# Altium project Main_board_massage.PrjPcb
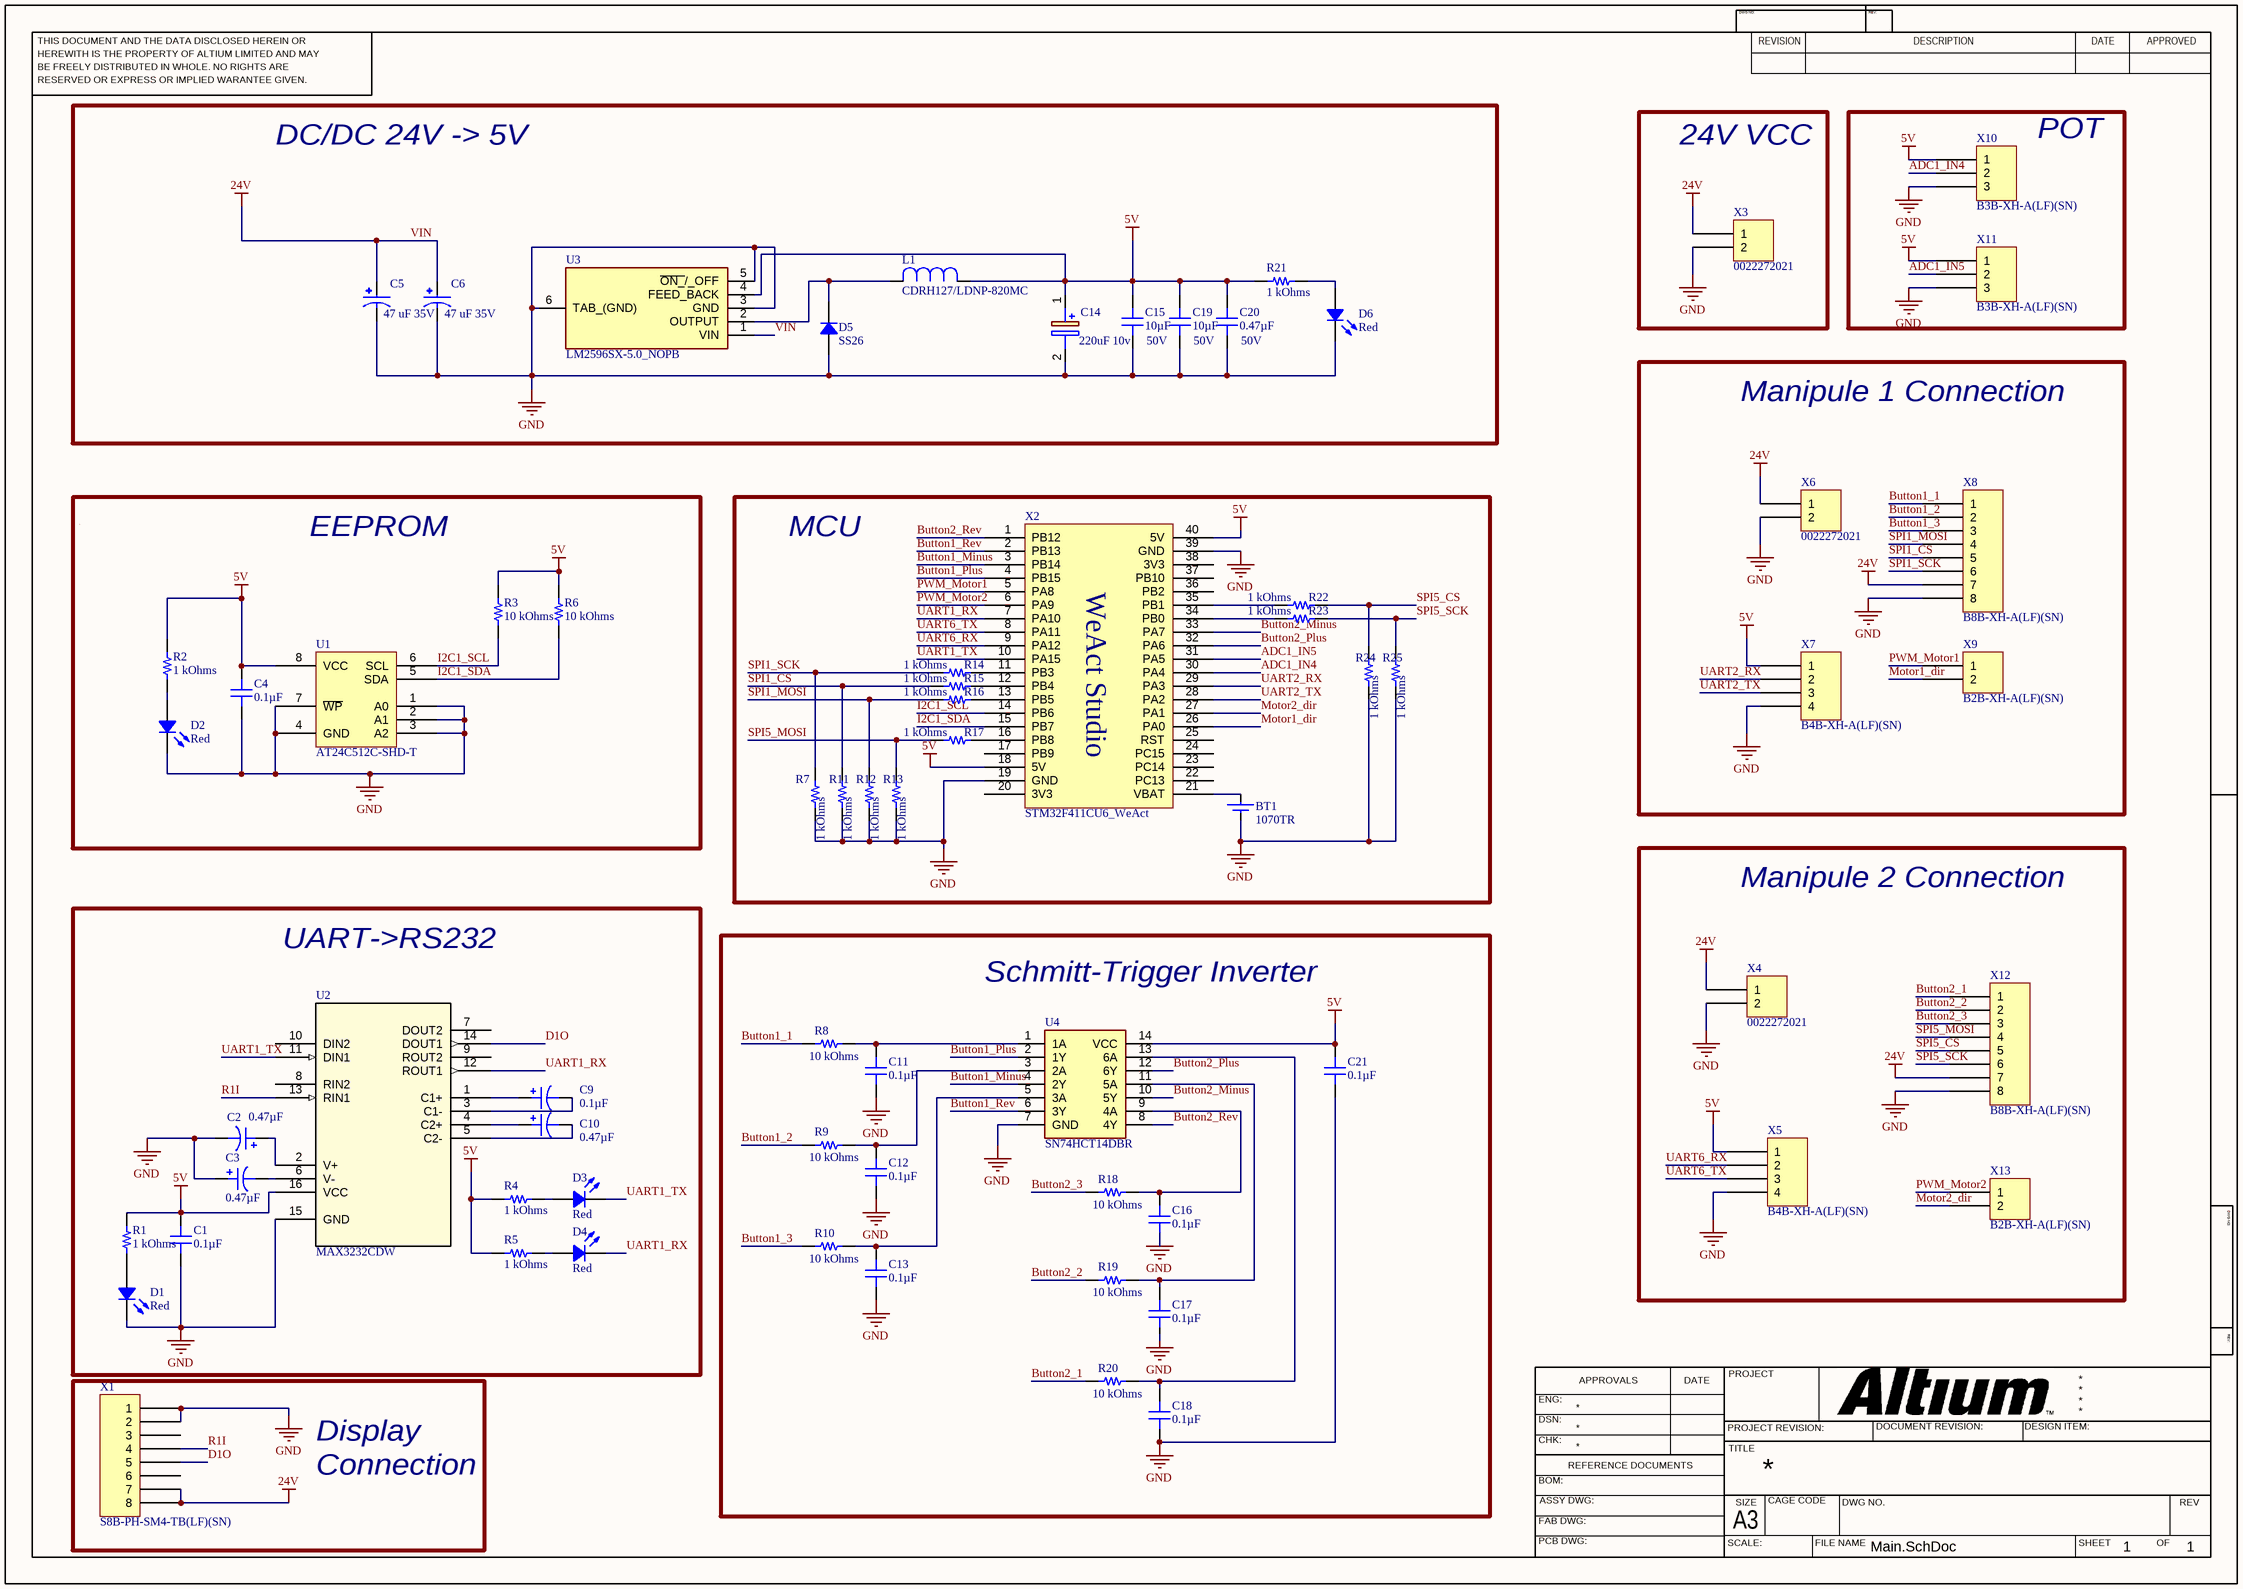
[diagram p0: Main.SchDoc]
1 sheet, 69 parts. Net scope: global (net labels, ports and power ports of the same name join across sheets).
Board file: Main_board.PcbDoc

## Sheet Main.SchDoc
size 420 x 297 mm; SheetNumber: 1; SheetTotal: 1

### Parts
BT1  1070TR  [1070TR]
C1  0.1µF  [CAP 0805_2012]
C2  0.47µF  [CAP POL 1206_3216]
C3  0.47µF  [CAP POL 1206_3216]
C4  0.1µF  [CAP 0805_2012]
C5  value 47 uF 35V  [CAP_EEHZA1V470P]  (hidden comment: EEHZA1V470P)
C6  value 47 uF 35V  [CAP_EEHZA1V470P]  (hidden comment: EEHZA1V470P)
C9  0.1µF  [CAP POL 1206_3216]
C10  0.47µF  [CAP POL 1206_3216]
C11  0.1µF  [CAP 0805_2012]
C12  0.1µF  [CAP 0805_2012]
C13  0.1µF  [CAP 0805_2012]
C14  Mouser Part Number: 220uF 10v  [CAPPM7343X430N]  (hidden comment: 293D227X9010E2TE3)
C15  Voltage - Rated: 50V  [CAP 0805_2012]  (hidden comment: 10µF)
C16  0.1µF  [CAP 0805_2012]
C17  0.1µF  [CAP 0805_2012]
C18  0.1µF  [CAP 0805_2012]
C19  Voltage - Rated: 50V  [CAP 0805_2012]  (hidden comment: 10µF)
C20  Voltage - Rated: 50V  [CAP 0805_2012]  (hidden comment: 0.47µF)
C21  0.1µF  [CAP 0805_2012]
D1  Red  [LED 0603_1608 RED]
D2  Red  [LED 0603_1608 RED]
D3  Red  [LED 0603_1608 RED]
D4  Red  [LED 0603_1608 RED]
D5  SS26  [DO214AA SMB]
D6  Red  [LED 0603_1608 RED]
L1  CDRH127/LDNP-820MC  [IND_CDRH127/LDNP-470MC_SUM]
R1  1 kOhms  [RES 0805_2012]
R2  1 kOhms  [RES 0805_2012]
R3  10 kOhms  [RES 0805_2012]
R4  1 kOhms  [RES 0805_2012]
R5  1 kOhms  [RES 0805_2012]
R6  10 kOhms  [RES 0805_2012]
R7  1 kOhms  [RES 0805_2012]
R8  10 kOhms  [RES 0805_2012]
R9  10 kOhms  [RES 0805_2012]
R10  10 kOhms  [RES 0805_2012]
R11  1 kOhms  [RES 0805_2012]
R12  1 kOhms  [RES 0805_2012]
R13  1 kOhms  [RES 0805_2012]
R14  1 kOhms  [RES 0805_2012]
R15  1 kOhms  [RES 0805_2012]
R16  1 kOhms  [RES 0805_2012]
R17  1 kOhms  [RES 0805_2012]
R18  10 kOhms  [RES 0805_2012]
R19  10 kOhms  [RES 0805_2012]
R20  10 kOhms  [RES 0805_2012]
R21  1 kOhms  [RES 0805_2012]
R22  1 kOhms  [RES 0805_2012]
R23  1 kOhms  [RES 0805_2012]
R24  1 kOhms  [RES 0805_2012]
R25  1 kOhms  [RES 0805_2012]
U1  AT24C512C-SHD-T  [MICROCHIP SOIC-8 208MIL WIDE]
U2  MAX3232CDW  [DW16]
U3  LM2596SX-5.0_NOPB  [KTT0005B]
U4  SN74HCT14DBR  [SOP65P780X200-14N]
X1  S8B-PH-SM4-TB(LF)(SN)  [JST S8B-PH-SM4-TB]
X2  STM32F411CU6_WeAct  [STM32F4x1CxU6 WeActStudio]
X3  0022272021  [MOLEX KK 0022272021]
X4  0022272021  [MOLEX KK 0022272021]
X5  B4B-XH-A(LF)(SN)  [JST XH B4B-XH-A]
X6  0022272021  [MOLEX KK 0022272021]
X7  B4B-XH-A(LF)(SN)  [JST XH B4B-XH-A]
X8  B8B-XH-A(LF)(SN)  [JST XH B8B-XH-A]
X9  B2B-XH-A(LF)(SN)  [JST XH B2B-XH-A]
X10  B3B-XH-A(LF)(SN)  [JST XH B3B-XH-A]
X11  B3B-XH-A(LF)(SN)  [JST XH B3B-XH-A]
X12  B8B-XH-A(LF)(SN)  [JST XH B8B-XH-A]
X13  B2B-XH-A(LF)(SN)  [JST XH B2B-XH-A]

### Blocks framed on the sheet
DC/DC 24V -> 5V: C5 C6 C14 C15 C19 C20 D5 D6 L1 R21 U3
24V VCC: X3
POT: X10 X11
Manipule 1 Connection: X6-X9
EEPROM: C4 D2 R2 R3 R6 U1
MCU: BT1 R7 R11-R17 R22-R25 X2
Manipule 2 Connection: X4 X5 X12 X13
UART->RS232: C1-C3 C9 C10 D1 D3 D4 R1 R4 R5 U2
Schmitt-Trigger Inverter: C11-C13 C16-C18 C21 R8-R10 R18-R20 U4

### Nets
5V: C1.2 C4.2 C14.1(+) C15.1 C19.1 C20.2 C21.2 L1.1 R1.2 R2.2 R3.2 R4.2 R5.2 R6.2 R21.2 U1.8(VCC) U2.16(VCC) U3.4(FEED_BACK) U4.14(VCC) X2.18(5V) X2.40(5V) X5.1 X7.1 X10.1 X11.1
GND: BT1.2(-) C1.1 C2.2 C3.1 C4.1 C5.2 C6.2 C11.1 C12.1 C13.1 C14.2(-) C15.2 C16.1 C17.1 C18.1 C19.2 C20.1 C21.1 D1.2 D2.2 D5.1 D6.2 R7.2 R11.2 R12.2 R13.2 R24.2 R25.2 U1.1(A0) U1.2(A1) U1.3(A2) U1.4(GND) U1.7(~{WP}) U2.15(GND) U3.3(GND) U3.5(~{ON_}/_OFF) U3.6(TAB_(GND)) U4.7(GND) X1.1 X1.2 X2.19(GND) X2.39(GND) X3.2 X4.2 X5.4 X6.2 X7.4 X8.8 X10.3 X11.3 X12.8
VIN: C5.1 C6.1 U3.1(VIN) X1.7 X1.8 X3.1 X4.1 X6.1 X8.7 X12.7  [also labelled 24V]
ADC1_IN4: X2.30(PA4) X10.2
ADC1_IN5: X2.31(PA5) X11.2
Button1_1: R8.2 X8.1
Button1_2: R9.2 X8.2
Button1_3: R10.2 X8.3
Button1_Minus: U4.4(2Y) X2.3(PB14)
Button1_Plus: U4.2(1Y) X2.4(PB15)
Button1_Rev: U4.6(3Y) X2.2(PB13)
Button2_1: R20.2 X12.1
Button2_2: R19.2 X12.2
Button2_3: R18.2 X12.3
Button2_Minus: U4.10(5Y) X2.33(PA7)
Button2_Plus: U4.12(6Y) X2.32(PA6)
Button2_Rev: U4.8(4Y) X2.1(PB12)
D1O: U2.14(DOUT1) X1.5
I2C1_SCL: R3.1 U1.6(SCL) X2.14(PB6)
I2C1_SDA: R6.1 U1.5(SDA) X2.15(PB7)
Motor1_dir: X2.26(PA0) X9.2
Motor2_dir: X2.27(PA1) X13.2
PWM_Motor1: X2.5(PA8) X9.1
PWM_Motor2: X2.6(PA9) X13.1
R1I: U2.13(RIN1) X1.4
SPI1_CS: R11.1 R15.2 X8.5
SPI1_MOSI: R12.1 R16.2 X8.4
SPI1_SCK: R7.1 R14.2 X8.6
SPI5_CS: R22.1 R24.1 X12.5
SPI5_MOSI: R13.1 R17.2 X12.4
SPI5_SCK: R23.1 R25.1 X12.6
UART1_RX: D4.2 U2.12(ROUT1) X2.7(PA10)
UART1_TX: D3.2 U2.11(DIN1) X2.10(PA15)
UART2_RX: X2.29(PA3) X7.2
UART2_TX: X2.28(PA2) X7.3
UART6_RX: X2.9(PA12) X5.2
UART6_TX: X2.8(PA11) X5.3
NetBT1_1: BT1.1(+) X2.21(VBAT)
NetC2_1: C2.1 U2.2(V+)
NetC3_2: C3.2 U2.6(V-)
NetC9_1: C9.1 U2.1(C1+)
NetC9_2: C9.2 U2.3(C1-)
NetC10_1: C10.1 U2.4(C2+)
NetC10_2: C10.2 U2.5(C2-)
NetC11_2: C11.2 R8.1 U4.1(1A)
NetC12_2: C12.2 R9.1 U4.3(2A)
NetC13_2: C13.2 R10.1 U4.5(3A)
NetC16_2: C16.2 R18.1 U4.9(4A)
NetC17_2: C17.2 R19.1 U4.11(5A)
NetC18_2: C18.2 R20.1 U4.13(6A)
NetD1_1: D1.1 R1.1
NetD2_1: D2.1 R2.1
NetD3_1: D3.1 R4.1
NetD4_1: D4.1 R5.1
NetD5_2: D5.2 L1.2 U3.2(OUTPUT)
NetD6_1: D6.1 R21.1
NetR14_1: R14.1 X2.11(PB3)
NetR15_1: R15.1 X2.12(PB4)
NetR16_1: R16.1 X2.13(PB5)
NetR17_1: R17.1 X2.16(PB8)
NetR22_2: R22.2 X2.35(PB1)
NetR23_2: R23.2 X2.34(PB0)

Not connected (* = marked no-connect by the designer): U2 7(DOUT2) 8(RIN2) 9(ROUT2) 10(DIN2); X1 3 6; X2 17(PB9) 20(3V3) 22(PC13) 23(PC14) 24(PC15) 25(RST) 36(PB2) 37(PB10) 38(3V3)

### Notes on the sheet
- Display
- Connection
- THIS DOCUMENT AND THE DATA DISCLOSED HEREIN OR
- HEREWITH IS THE PROPERTY OF ALTIUM LIMITED AND MAY
- DWG NO:
- REVISION
- REV:
- DESCRIPTION
- DATE
- APPROVED
- BE FREELY DISTRIBUTED IN WHOLE. NO RIGHTS ARE
- RESERVED OR EXPRESS OR IMPLIED WARANTEE GIVEN.
- ENG:
- APPROVALS
- PROJECT
- DSN:
- CHK:
- REFERENCE DOCUMENTS
- PROJECT REVISION:
- TITLE
- DOCUMENT REVISION:
- DESIGN ITEM:
- BOM:
- FAB DWG:
- PCB DWG:
- ASSY DWG:
- SCALE:
- A3
- SIZE
- CAGE CODE
- FILE NAME
- DWG NO.
- SHEET
- OF
- REV
- (in symbol STM32F411CU6_WeAct) WeAct Studio

### Library data of the parts
BT1 = 1070TR: Battery; Manufacturer_Name: Keystone Electronics; Datasheet Link: https://www.keyelco.com/product-pdf.cfm?p=14018; Height: 6.22mm; Manufacturer_Part_Number: 1070TR; Mouser Part Number: 534-1070TR; Mouser Price/Stock: https://www.mouser.co.uk/ProductDetail/Keystone-Electronics/1070TR?qs=76dmnhCH%2FMN2NfD64M7eLg%3D%3D
C1 C4 C11-C13 C16-C18 C21 = C0805C104K9RACAUTO: SMD AUTO X7R, CERAMIC, 0.1 UF, 1; Manufacturer: KEMET; Tolerance: ±10%; Voltage - Rated: 6.3V; Part Number: C0805C104K9RACAUTO; Value: 0.1µF; Applications: Automotive, Bypass, Decoupling; Capacitance: 0.1µF; ComponentLink1Description: Datasheet; ComponentLink1URL: https://api.kemet.com/component-edge/download/datasheet/C0805C104K9RACAUTO.pdf; ComponentLink2Description: DigiKey Link; ComponentLink2URL: http://digikey.com/product-detail/en/kemet/C0805C104K9RACAUTO/399-C0805C104K9RACAUTOCT-ND/10232873; Device Package: 0805 (2012 Metric); LastUpdated: 02.09.2020 01:04:08; Lifecycle Status: Active; Minimum Order: 1; Mounting Type: Surface Mount, MLCC; Operating Temperature: -55°C ~ 125°C; Package / Case: 0805 (2012 Metric); Packaging: TapeAndReel; PartId: 17729; Part Status: Active; Price: 0.05; Ratings: AEC-Q200; Series: SMD Auto X7R; Size / Dimension: 0.079" L x 0.049" W (2.00mm x 1.25mm); Supplier 1: DigiKey; Supplier Part Number 1: 399-C0805C104K9RACAUTOCT-ND; Temperature Coefficient: X7R; Thickness (Max): 0.035" (0.88mm)
C2 C3 C10 = 293D474X9035A2TE3: CAP TANT 0.47UF 10% 35V 1206; Manufacturer: Vishay Sprague; Manufacturer Size Code: A; ESR (Equivalent Series Resistance): 10Ohm; Type: Molded; Part Number: 293D474X9035A2TE3; Value: 0.47µF; Capacitance: 0.47µF; ComponentLink1Description: Datasheet; ComponentLink1URL: http://www.vishay.com/docs/40002/293d.pdf; ComponentLink2Description: DigiKey Link; ComponentLink2URL: http://digikey.com/product-detail/en/vishay-sprague/293D474X9035A2TE3/718-1808-1-ND/2259950; Device Package: 1206 (3216 Metric); Features: General Purpose; Height - Seated (Max): 0.071" (1.80mm); LastUpdated: 02.09.2020 01:15:57; Lifecycle Status: Active; Minimum Order: 1; Mounting Type: Surface Mount; Operating Temperature: -55°C ~ 125°C; Package / Case: 1206 (3216 Metric); Packaging: TapeAndReel; PartId: 592; Part Status: Active; Price: 0.12; Series: TANTAMOUNT®, 293D; Size / Dimension: 0.126" L x 0.063" W (3.20mm x 1.60mm); Supplier 1: DigiKey; Supplier Part Number 1: 718-1808-1-ND; Tolerance: ±10%; Voltage - Rated: 35V
C5 C6 = EEHZA1V470P: CAP ALUM POLY HYB 47UF 35V SMD; MF: {'manufacturer': u'Panasonic Electronic'}; Price: None; Package: None; MP: EEHZA1V470P; Availability: Unavailable
C9 = 293D104X0035A2TE3: CAP TANT 0.1UF 20% 35V 1206; Manufacturer: Vishay Sprague; Manufacturer Size Code: A; ESR (Equivalent Series Resistance): 20Ohm; Type: Molded; Part Number: 293D104X0035A2TE3; Value: 0.1µF; Capacitance: 0.1µF; ComponentLink1Description: Datasheet; ComponentLink1URL: http://www.vishay.com/docs/40002/293d.pdf; ComponentLink2Description: DigiKey Link; ComponentLink2URL: http://digikey.com/product-detail/en/vishay-sprague/293D104X0035A2TE3/718-293D104X0035A2TE3CT-ND/10506968; Device Package: 1206 (3216 Metric); Features: General Purpose; Height - Seated (Max): 0.071" (1.80mm); LastUpdated: 02.09.2020 01:15:53; Lifecycle Status: Active; Minimum Order: 1; Mounting Type: Surface Mount; Operating Temperature: -55°C ~ 125°C; Package / Case: 1206 (3216 Metric); Packaging: TapeAndReel; PartId: 2092; Part Status: Active; Price: 0.09; Series: TANTAMOUNT®, 293D; Size / Dimension: 0.126" L x 0.063" W (3.20mm x 1.60mm); Supplier 1: DigiKey; Supplier Part Number 1: 718-293D104X0035A2TE3CT-ND; Tolerance: ±20%; Voltage - Rated: 35V
C14 = 293D227X9010E2TE3: Tantalum Capacitors - Solid SMD 220uF 10volts 10% E case Molded; Manufacturer_Name: Vishay; Datasheet Link: http://www.vishay.com/docs/40002/293d.pdf; Height: 4.3mm; Manufacturer_Part_Number: 293D227X9010E2TE3
C15 C19 = GRM21BR61H106KE43L: 0805 (2012MM) X5R (EIA) 50VDC 10; Manufacturer: Murata Electronics; Tolerance: ±10%; Part Number: GRM21BR61H106KE43L; Value: 10µF; Applications: General Purpose; Capacitance: 10µF; ComponentLink1Description: Datasheet; ComponentLink1URL: https://search.murata.co.jp/Ceramy/image/img/A01X/G101/ENG/GRM21BR61H106KE43-01A.pdf; ComponentLink2Description: DigiKey Link; ComponentLink2URL: http://digikey.com/product-detail/en/murata-electronics/GRM21BR61H106KE43L/490-18663-1-ND/10326328; Device Package: 0805 (2012 Metric); LastUpdated: 02.09.2020 01:04:31; Lifecycle Status: Active; Minimum Order: 1; Mounting Type: Surface Mount, MLCC; Operating Temperature: -55°C ~ 85°C; Package / Case: 0805 (2012 Metric); Packaging: TapeAndReel; PartId: 8559; Part Status: Active; Price: 0.10; Series: GRM; Size / Dimension: 0.079" L x 0.049" W (2.00mm x 1.25mm); Supplier 1: DigiKey; Supplier Part Number 1: 490-18663-1-ND; Temperature Coefficient: X5R; Thickness (Max): 0.057" (1.45mm)
C20 = GCM21BR71H474KA55L: CAP CER 0.47UF 50V X7R 0805; Manufacturer: Murata Electronics; Tolerance: ±10%; Part Number: GCM21BR71H474KA55L; Value: 0.47µF; Applications: Automotive; Capacitance: 0.47µF; ComponentLink1Description: Datasheet; ComponentLink1URL: https://www.murata.com/~/media/webrenewal/support/library/catalog/products/capacitor/mlcc/c03e.ashx?la=en-us; ComponentLink2Description: DigiKey Link; ComponentLink2URL: http://digikey.com/product-detail/en/murata-electronics/GCM21BR71H474KA55L/490-4788-1-ND/1641707; Device Package: 0805 (2012 Metric); LastUpdated: 02.09.2020 01:04:31; Lifecycle Status: Active; Minimum Order: 1; Mounting Type: Surface Mount, MLCC; Operating Temperature: -55°C ~ 125°C; Package / Case: 0805 (2012 Metric); Packaging: TapeAndReel; PartId: 8527; Part Status: Active; Price: 0.08; Ratings: AEC-Q200; Series: GCM; Size / Dimension: 0.079" L x 0.049" W (2.00mm x 1.25mm); Supplier 1: DigiKey; Supplier Part Number 1: 490-4788-1-ND; Temperature Coefficient: X7R; Thickness (Max): 0.055" (1.40mm)
D1-D4 D6 = 19-213USRC/S259/TR8: LED RED CLEAR 2SMD; Manufacturer: Everlight Electronics Co Ltd; Configuration: Standard; Current - Test: 25mA; Lens Color: Colorless; Lens Size: 1.20mm x 0.80mm; Lens Style: Rectangle with Flat Top; Viewing Angle: 120°; Voltage - Forward (Vf) (Typ): 2.1V; Wavelength - Peak: 639nm; Part Number: 19-213USRC/S259/TR8; Color: Red; ComponentLink1Description: Datasheet; ComponentLink1URL: //media.digikey.com/pdf/Data%20Sheets/Everlight%20PDFs/19-213USRC-S259-TR8.pdf; ComponentLink2Description: DigiKey Link; ComponentLink2URL: http://digikey.com/product-detail/en/everlight-electronics-co-ltd/19-213USRC-S259-TR8/1080-1583-1-ND/8535306; Device Package: 0603 (1608 Metric); Height (Max): 0.70mm; LastUpdated: 02.09.2020 01:20:56; Lens Transparency: Clear; Lifecycle Status: Active; Minimum Order: 1; Mounting Type: Surface Mount; Package / Case: 0603 (1608 Metric); Packaging: TapeAndReel; PartId: 415; Part Status: Active; Price: 0.03; Series: -; Size / Dimension: 1.60mm L x 0.80mm W; Supplier 1: DigiKey; Supplier Part Number 1: 1080-1583-1-ND; Supplier Device Package: 2-SMD; Value: Red
D5 = SS26: DIODE SCHOTTKY 60V 2A DO214AA; Manufacturer: ON Semiconductor; Current - Reverse Leakage @ Vr: 400µA @ 60V; Speed: Fast Recovery =< 500ns, > 200mA (Io); Voltage - Forward (Vf) (Max) @ If: 700mV @ 2A; Part Number: SS26; ComponentLink1Description: Datasheet; ComponentLink1URL: https://www.onsemi.com/pub/Collateral/SS29-D.pdf; ComponentLink2Description: DigiKey Link; ComponentLink2URL: http://digikey.com/product-detail/en/on-semiconductor/SS26/SS26FSCT-ND/965731; Current - Average Rectified (Io): 2A; Diode Type: Schottky; LastUpdated: 21.05.2023 20:09:05; Lifecycle Status: Active; Minimum Order: 1; Mounting Type: Surface Mount; Operating Temperature - Junction: -65°C ~ 125°C; Package / Case: DO-214AA, SMB; Packaging: TapeAndReel; PartId: 1378; Part Status: Active; Price: 0.09; Series: -; Supplier 1: DigiKey; Supplier Part Number 1: SS26FSCT-ND; Supplier Device Package: DO-214AA (SMB); Voltage - DC Reverse (Vr) (Max): 60V
L1 = CDRH127/LDNP-470MC: 47 ÂµH Shielded - Inductor 3.25 A 78mOhm Max Nonstandard; MF: Sumida America; SnapEDA_Link: https://www.snapeda.com/parts/CDRH127/LDNP-470MC/Sumida+America+Components+Inc./view-part/?ref=snap; MP: CDRH127/LDNP-470MC; Availability: In Stock; Price: None; Value: *; Check_prices: https://www.snapeda.com/parts/CDRH127/LDNP-470MC/Sumida+America+Components+Inc./view-part/?ref=eda; Package: Nonstandard Sumida; Purchase-URL: https://pricing.snapeda.com/search/part/CDRH127/LDNP-470MC/?ref=eda
R1 R2 R4 R5 R7 R11-R17 R21-R25 = RT0805BRE071KL: RES SMD 1K OHM 0.1% 1/8W 0805; Manufacturer: Yageo; Power (Watts): 0.125W, 1/8W; Temperature Coefficient: ±50ppm/°C; Part Number: RT0805BRE071KL; Value: 1 kOhms; ComponentLink1Description: Datasheet; ComponentLink1URL: https://www.yageo.com/upload/media/product/productsearch/datasheet/rchip/PYu-RT_1-to-0.01_RoHS_L_11.pdf; ComponentLink2Description: DigiKey Link; ComponentLink2URL: http://digikey.com/product-detail/en/yageo/RT0805BRE071KL/YAG2328CT-ND/5252442; Composition: Thin Film; Device Package: 0805 (2012 Metric); Height - Seated (Max): 0.024" (0.60mm); LastUpdated: 02.09.2020 01:15:19; Lifecycle Status: Active; Minimum Order: 1; Number of Terminations: 2; Operating Temperature: -55°C ~ 155°C; Package / Case: 0805 (2012 Metric); Packaging: TapeAndReel; PartId: 29992; Part Status: Active; Price: 0.06; Resistance: 1 kOhms; Series: RT; Size / Dimension: 0.079" L x 0.049" W (2.00mm x 1.25mm); Supplier 1: DigiKey; Supplier Part Number 1: YAG2328CT-ND; Supplier Device Package: 0805; Tolerance: ±0.1%
R3 R6 R8-R10 R18-R20 = RT0805DRD0710KL: RES SMD 10K OHM 0.5% 1/8W 0805; Manufacturer: Yageo; Power (Watts): 0.125W, 1/8W; Temperature Coefficient: ±25ppm/°C; Part Number: RT0805DRD0710KL; Value: 10 kOhms; ComponentLink1Description: Datasheet; ComponentLink1URL: https://www.yageo.com/upload/media/product/productsearch/datasheet/rchip/PYu-RT_1-to-0.01_RoHS_L_11.pdf; ComponentLink2Description: DigiKey Link; ComponentLink2URL: http://digikey.com/product-detail/en/yageo/RT0805DRD0710KL/311-2699-1-ND/6129118; Composition: Thin Film; Device Package: 0805 (2012 Metric); Height - Seated (Max): 0.024" (0.60mm); LastUpdated: 02.09.2020 01:15:24; Lifecycle Status: Active; Minimum Order: 1; Number of Terminations: 2; Operating Temperature: -55°C ~ 155°C; Package / Case: 0805 (2012 Metric); Packaging: TapeAndReel; PartId: 27797; Part Status: Active; Price: 0.03; Resistance: 10 kOhms; Series: RT; Size / Dimension: 0.079" L x 0.049" W (2.00mm x 1.25mm); Supplier 1: DigiKey; Supplier Part Number 1: 311-2699-1-ND; Supplier Device Package: 0805; Tolerance: ±0.5%
U1 = AT24C512C-SHD-T: IC EEPROM 512K I2C 1MHZ 8SOIC; Manufacturer: Microchip Technology; Access Time: 550ns; Memory Interface: I²C; Memory Size: 512Kb (64K x 8); Memory Type: Non-Volatile; Voltage - Supply: 2.5V ~ 5.5V; Write Cycle Time - Word, Page: 5ms; Part Number: AT24C512C-SHD-T; Clock Frequency: 1MHz; ComponentLink1Description: Datasheet; ComponentLink1URL: http://www.microchip.com/mymicrochip/filehandler.aspx?ddocname=en590134; ComponentLink2Description: DigiKey Link; ComponentLink2URL: http://digikey.com/product-detail/en/microchip-technology/AT24C512C-SHD-T/AT24C512C-SHD-TCT-ND/3178476; LastUpdated: 02.09.2020 01:23:05; Lifecycle Status: Active; Memory Format: EEPROM; Minimum Order: 1; Mounting Type: Surface Mount; Operating Temperature: -40°C ~ 85°C (TA); Package / Case: 8-SOIC (0.209", 5.30mm Width); Packaging: TapeAndReel; PartId: 883; Part Status: Active; Price: 0.91; Series: -; Supplier 1: DigiKey; Supplier Part Number 1: AT24C512C-SHD-TCT-ND; Supplier Device Package: 8-SOIC; Technology: EEPROM
U2 = MAX3232CDW: No Description Available; Mfr_Name: Texas Instruments; Copyright: Copyright (C) 2022 Ultra Librarian. All rights reserved.; Manufacturer_Part_Number: MAX3232CDW; RefDes: RefDes; Type: DEV
U3 = LM2596SX-5.0_NOPB: Integrated Circuit; Manufacturer_Name: Texas Instruments; Manufacturer_Part_Number: LM2596SX-5.0/NOPB; Datasheet Link: http://www.ti.com/lit/gpn/lm2596; Mouser Part Number: 926-LM2596SX-5.0NOPB; Mouser Price/Stock: https://www.mouser.co.uk/ProductDetail/Texas-Instruments/LM2596SX-5.0-NOPB?qs=X1J7HmVL2ZGZ5T4VcWdmNw%3D%3D; Arrow Part Number: LM2596SX-5.0/NOPB; Arrow Price/Stock: https://www.arrow.com/en/products/lm2596sx-5.0nopb/texas-instruments?region=nac
U4 = SN74HCT14DBR: Integrated Circuit; Manufacturer_Name: Texas Instruments; Datasheet Link: http://www.ti.com/lit/gpn/sn74hct14; Height: 2mm; Manufacturer_Part_Number: SN74HCT14DBR; Mouser Part Number: 595-SN74HCT14DBR; Mouser Price/Stock: https://www.mouser.co.uk/ProductDetail/Texas-Instruments/SN74HCT14DBR?qs=dQbkqP7qjaYIMikAy6u%2FSg%3D%3D; Arrow Part Number: SN74HCT14DBR; Arrow Price/Stock: https://www.arrow.com/en/products/sn74hct14dbr/texas-instruments
X1 = S8B-PH-SM4-TB(LF)(SN): CONN HEADER SMD R/A 8POS 2MM; Manufacturer: JST Sales America Inc.; Contact Length - Mating: 0.130" (3.30mm); Current Rating (Amps): 2A; Material Flammability Rating: UL94 V-0; Number of Positions: 8; Number of Positions Loaded: All; Pitch - Mating: 0.079" (2.00mm); Shrouding: Shrouded - 4 Wall; Style: Board to Cable/Wire; Voltage Rating: 100V; Part Number: S8B-PH-SM4-TB(LF)(SN); ComponentLink1Description: Datasheet; ComponentLink1URL: http://www.jst-mfg.com/product/pdf/eng/ePH.pdf; ComponentLink2Description: DigiKey Link; ComponentLink2URL: http://digikey.com/product-detail/en/jst-sales-america-inc/S8B-PH-SM4-TB-LF-SN/455-1755-1-ND/926852; Connector Type: Header; Contact Finish - Mating: Tin; Contact Finish - Post: Tin; Contact Material: Copper Alloy; Contact Shape: Square; Contact Type: Male Pin; Fastening Type: Detent Lock; Features: Solder Retention; Insulation Color: Natural; Insulation Height: 0.217" (5.51mm); Insulation Material: Polyamide (PA6T), Nylon 6T; LastUpdated: 15.01.2020 03:39:20; Lifecycle Status: Active; Minimum Order: 1; Mounting Type: Surface Mount, Right Angle; Number of Rows: 1; Operating Temperature: -25°C ~ 85°C; Packaging: TapeAndReel; PartId: 114; Part Status: Active; Price: 0.49; Series: PH; Supplier 1: DigiKey; Supplier Part Number 1: 455-1755-1-ND; Termination: Solder
X3 X4 X6 = 0022272021: CONN HEADER VERT 2POS 2.54MM; Manufacturer: Molex; Contact Length - Mating: 0.295" (7.49mm); Contact Length - Post: 0.140" (3.56mm); Material Flammability Rating: UL94 V-0; Number of Positions: 2; Number of Positions Loaded: All; Overall Contact Length: 0.560" (14.22mm); Pitch - Mating: 0.100" (2.54mm); Shrouding: Shrouded - 1 Wall; Style: Board to Cable/Wire; Part Number: 0022272021; ComponentLink1Description: Datasheet; ComponentLink1URL: https://www.molex.com/pdm_docs/sd/022272021_sd.pdf; ComponentLink2Description: DigiKey Link; ComponentLink2URL: http://digikey.com/product-detail/en/molex/0022272021/WM4111-ND/1130577; LastUpdated: 12.01.2020 23:51:43; Lifecycle Status: Active; Minimum Order: 1; Mounting Type: Through Hole; Packaging: Bulk; Part Status: Active; Price: 0.27; Series: KK 6410; Supplier 1: DigiKey; Supplier Part Number 1: WM4111-ND; Connector Type: Header; Contact Finish - Mating: Tin; Contact Finish - Post: Tin; Contact Finish Thickness - Mating: 100.0µin (2.54µm); Contact Material: Brass; Contact Shape: Square; Contact Type: Male Pin; Fastening Type: Friction Lock; Insulation Color: Natural; Insulation Height: 0.461" (11.70mm); Insulation Material: Polyamide (PA), Nylon; Number of Rows: 1; PartId: 76; Termination: Solder
X5 X7 = B4B-XH-A(LF)(SN): CONN HEADER VERT 4POS 2.5MM; Manufacturer: JST Sales America Inc.; Contact Length - Post: 0.134" (3.40mm); Current Rating (Amps): 3A; Material Flammability Rating: UL94 V-0; Number of Positions: 4; Number of Positions Loaded: All; Pitch - Mating: 0.098" (2.50mm); Shrouding: Shrouded - 4 Wall; Style: Board to Cable/Wire; Voltage Rating: 250V; Part Number: B4B-XH-A(LF)(SN); ComponentLink1Description: Datasheet; ComponentLink1URL: http://www.jst-mfg.com/product/pdf/eng/eXH.pdf; ComponentLink2Description: DigiKey Link; ComponentLink2URL: http://digikey.com/product-detail/en/jst-sales-america-inc/B4B-XH-A-LF-SN/455-2249-ND/1651047; Connector Type: Header; Contact Finish - Mating: Tin; Contact Finish - Post: Tin; Contact Material: Brass; Contact Shape: Square; Contact Type: Male Pin; Fastening Type: Detent Lock; Insulation Color: Natural; Insulation Height: 0.276" (7.00mm); Insulation Material: Polyamide (PA66), Nylon 6/6; LastUpdated: 12.01.2020 23:46:34; Lifecycle Status: Active; Minimum Order: 1; Mounting Type: Through Hole; Number of Rows: 1; Operating Temperature: -25°C ~ 85°C; Packaging: Bulk; PartId: 69; Part Status: Active; Price: 0.21; Series: XH; Supplier 1: DigiKey; Supplier Part Number 1: 455-2249-ND; Termination: Press-Fit, Solder
X8 X12 = B8B-XH-A(LF)(SN): CONN HEADER VERT 8POS 2.5MM; Manufacturer: JST Sales America Inc.; Contact Length - Post: 0.134" (3.40mm); Current Rating (Amps): 3A; Material Flammability Rating: UL94 V-0; Number of Positions: 8; Number of Positions Loaded: All; Pitch - Mating: 0.098" (2.50mm); Shrouding: Shrouded - 4 Wall; Style: Board to Cable/Wire; Voltage Rating: 250V; Part Number: B8B-XH-A(LF)(SN); ComponentLink1Description: Datasheet; ComponentLink1URL: http://www.jst-mfg.com/product/pdf/eng/eXH.pdf; ComponentLink2Description: DigiKey Link; ComponentLink2URL: http://digikey.com/product-detail/en/jst-sales-america-inc/B8B-XH-A-LF-SN/455-2251-ND/1651049; Connector Type: Header; Contact Finish - Mating: Tin; Contact Finish - Post: Tin; Contact Material: Brass; Contact Shape: Square; Contact Type: Male Pin; Fastening Type: Detent Lock; Insulation Color: Natural; Insulation Height: 0.276" (7.00mm); Insulation Material: Polyamide (PA66), Nylon 6/6; LastUpdated: 12.01.2020 23:47:22; Lifecycle Status: Active; Minimum Order: 1; Mounting Type: Through Hole; Number of Rows: 1; Operating Temperature: -25°C ~ 85°C; Packaging: Bulk; PartId: 73; Part Status: Active; Price: 0.36; Series: XH; Supplier 1: DigiKey; Supplier Part Number 1: 455-2251-ND; Termination: Press-Fit, Solder
X9 X13 = B2B-XH-A(LF)(SN): CONN HEADER VERT 2POS 2.5MM; Manufacturer: JST Sales America Inc.; Contact Length - Post: 0.134" (3.40mm); Current Rating (Amps): 3A; Material Flammability Rating: UL94 V-0; Number of Positions: 2; Number of Positions Loaded: All; Pitch - Mating: 0.098" (2.50mm); Shrouding: Shrouded - 4 Wall; Style: Board to Cable/Wire; Voltage Rating: 250V; Part Number: B2B-XH-A(LF)(SN); ComponentLink1Description: Datasheet; ComponentLink1URL: http://www.jst-mfg.com/product/pdf/eng/eXH.pdf; ComponentLink2Description: DigiKey Link; ComponentLink2URL: http://digikey.com/product-detail/en/jst-sales-america-inc/B2B-XH-A-LF-SN/455-2247-ND/1651045; Connector Type: Header; Contact Finish - Mating: Tin; Contact Finish - Post: Tin; Contact Material: Brass; Contact Shape: Square; Contact Type: Male Pin; Fastening Type: Detent Lock; Insulation Color: Natural; Insulation Height: 0.276" (7.00mm); Insulation Material: Polyamide (PA66), Nylon 6/6; LastUpdated: 12.01.2020 23:46:08; Lifecycle Status: Active; Minimum Order: 1; Mounting Type: Through Hole; Number of Rows: 1; Operating Temperature: -25°C ~ 85°C; Packaging: Bulk; PartId: 67; Part Status: Active; Price: 0.15; Series: XH; Supplier 1: DigiKey; Supplier Part Number 1: 455-2247-ND; Termination: Press-Fit, Solder
X10 X11 = B3B-XH-A(LF)(SN): CONN HEADER VERT 3POS 2.5MM; Manufacturer: JST Sales America Inc.; Contact Length - Post: 0.134" (3.40mm); Current Rating (Amps): 3A; Material Flammability Rating: UL94 V-0; Number of Positions: 3; Number of Positions Loaded: All; Pitch - Mating: 0.098" (2.50mm); Shrouding: Shrouded - 4 Wall; Style: Board to Cable/Wire; Voltage Rating: 250V; Part Number: B3B-XH-A(LF)(SN); ComponentLink1Description: Datasheet; ComponentLink1URL: http://www.jst-mfg.com/product/pdf/eng/eXH.pdf; ComponentLink2Description: DigiKey Link; ComponentLink2URL: http://digikey.com/product-detail/en/jst-sales-america-inc/B3B-XH-A-LF-SN/455-2248-ND/1651046; Connector Type: Header; Contact Finish - Mating: Tin; Contact Finish - Post: Tin; Contact Material: Brass; Contact Shape: Square; Contact Type: Male Pin; Fastening Type: Detent Lock; Insulation Color: Natural; Insulation Height: 0.276" (7.00mm); Insulation Material: Polyamide (PA66), Nylon 6/6; LastUpdated: 12.01.2020 23:46:22; Lifecycle Status: Active; Minimum Order: 1; Mounting Type: Through Hole; Number of Rows: 1; Operating Temperature: -25°C ~ 85°C; Packaging: Bulk; PartId: 68; Part Status: Active; Price: 0.19; Series: XH; Supplier 1: DigiKey; Supplier Part Number 1: 455-2248-ND; Termination: Press-Fit, Solder